# Altium schematic sheet 04_ZYNQ_CLOCK&PIN_CONFIG.SchDoc
size A4; SheetNumber: 5; SheetTotal: 5
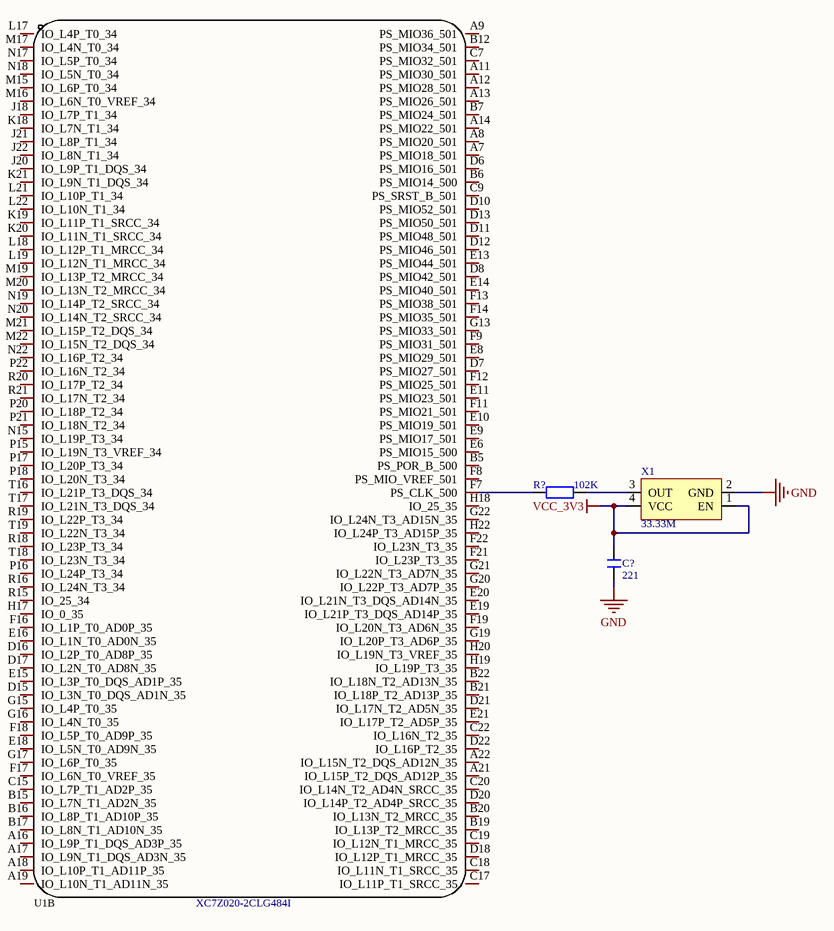
[diagram p0: 04_ZYNQ_CLOCK&PIN_CONFIG.SchDoc]

## Parts
C?  221  [C 0402]
R?  102K  [R 0402]
U1  XC7Z020-2CLG484I  [FPBGA-484_L19.0-W19.0-R22-C22-P0.80-BL]  (part B of 4)
X1  33.33M  [XTAL-3225 - S]

## Nets
GND: C?.1 X1.2(GND)
VCC_3V3: C?.2 X1.1(EN) X1.4(VCC)
NetR?_1: R?.1 U1.F7(PS_CLK_500)
NetR?_2: R?.2 X1.3(OUT)

Not connected (* = marked no-connect by the designer): U1 A7(PS_MIO18_501) A8(PS_MIO20_501) A9(PS_MIO36_501) A11(PS_MIO30_501) A12(PS_MIO28_501) A13(PS_MIO26_501) A14(PS_MIO22_501) A16(IO_L9P_T1_DQS_AD3P_35) A17(IO_L9N_T1_DQS_AD3N_35) A18(IO_L10P_T1_AD11P_35) A19(IO_L10N_T1_AD11N_35) A21(IO_L15P_T2_DQS_AD12P_35) A22(IO_L15N_T2_DQS_AD12N_35) B5(PS_POR_B_500) B6(PS_MIO14_500) B7(PS_MIO24_501) B12(PS_MIO34_501) B15(IO_L7N_T1_AD2N_35) B16(IO_L8P_T1_AD10P_35) B17(IO_L8N_T1_AD10N_35) B19(IO_L13P_T2_MRCC_35) B20(IO_L13N_T2_MRCC_35) B21(IO_L18P_T2_AD13P_35) B22(IO_L18N_T2_AD13N_35) C7(PS_MIO32_501) C9(PS_SRST_B_501) C15(IO_L7P_T1_AD2P_35) C17(IO_L11P_T1_SRCC_35) C18(IO_L11N_T1_SRCC_35) C19(IO_L12N_T1_MRCC_35) C20(IO_L14N_T2_AD4N_SRCC_35) C22(IO_L16N_T2_35) D6(PS_MIO16_501) D7(PS_MIO27_501) D8(PS_MIO42_501) D10(PS_MIO52_501) D11(PS_MIO48_501) D12(PS_MIO46_501) D13(PS_MIO50_501) D15(IO_L3N_T0_DQS_AD1N_35) D16(IO_L2P_T0_AD8P_35) D17(IO_L2N_T0_AD8N_35) D18(IO_L12P_T1_MRCC_35) D20(IO_L14P_T2_AD4P_SRCC_35) D21(IO_L17N_T2_AD5N_35) D22(IO_L16P_T2_35) E6(PS_MIO15_500) E8(PS_MIO29_501) E9(PS_MIO17_501) E10(PS_MIO19_501) E11(PS_MIO23_501) E13(PS_MIO44_501) E14(PS_MIO40_501) E15(IO_L3P_T0_DQS_AD1P_35) E16(IO_L1N_T0_AD0N_35) E18(IO_L5N_T0_AD9N_35) E19(IO_L21P_T3_DQS_AD14P_35) E20(IO_L21N_T3_DQS_AD14N_35) E21(IO_L17P_T2_AD5P_35) F8(PS_MIO_VREF_501) F9(PS_MIO31_501) F11(PS_MIO21_501) F12(PS_MIO25_501) F13(PS_MIO38_501) F14(PS_MIO35_501) F16(IO_L1P_T0_AD0P_35) F17(IO_L6N_T0_VREF_35) F18(IO_L5P_T0_AD9P_35) F19(IO_L20N_T3_AD6N_35) F21(IO_L23P_T3_35) F22(IO_L23N_T3_35) G13(PS_MIO33_501) G15(IO_L4P_T0_35) G16(IO_L4N_T0_35) G17(IO_L6P_T0_35) G19(IO_L20P_T3_AD6P_35) G20(IO_L22P_T3_AD7P_35) G21(IO_L22N_T3_AD7N_35) G22(IO_L24N_T3_AD15N_35) H17(IO_0_35) H18(IO_25_35) H19(IO_L19P_T3_35) H20(IO_L19N_T3_VREF_35) H22(IO_L24P_T3_AD15P_35) J18(IO_L7P_T1_34) J20(IO_L9P_T1_DQS_34) J21(IO_L8P_T1_34) J22(IO_L8N_T1_34) K18(IO_L7N_T1_34) K19(IO_L11P_T1_SRCC_34) K20(IO_L11N_T1_SRCC_34) K21(IO_L9N_T1_DQS_34) L17(IO_L4P_T0_34) L18(IO_L12P_T1_MRCC_34) L19(IO_L12N_T1_MRCC_34) L21(IO_L10P_T1_34) L22(IO_L10N_T1_34) M15(IO_L6P_T0_34) M16(IO_L6N_T0_VREF_34) M17(IO_L4N_T0_34) M19(IO_L13P_T2_MRCC_34) M20(IO_L13N_T2_MRCC_34) M21(IO_L15P_T2_DQS_34) M22(IO_L15N_T2_DQS_34) N15(IO_L19P_T3_34) N17(IO_L5P_T0_34) N18(IO_L5N_T0_34) N19(IO_L14P_T2_SRCC_34) N20(IO_L14N_T2_SRCC_34) N22(IO_L16P_T2_34) P15(IO_L19N_T3_VREF_34) P16(IO_L24P_T3_34) P17(IO_L20P_T3_34) P18(IO_L20N_T3_34) P20(IO_L18P_T2_34) P21(IO_L18N_T2_34) P22(IO_L16N_T2_34) R15(IO_25_34) R16(IO_L24N_T3_34) R18(IO_L23P_T3_34) R19(IO_L22P_T3_34) R20(IO_L17P_T2_34) R21(IO_L17N_T2_34) T16(IO_L21P_T3_DQS_34) T17(IO_L21N_T3_DQS_34) T18(IO_L23N_T3_34) T19(IO_L22N_T3_34)

## Library data of the parts
C? = C: 无极性贴片电容; 版权归属: 源创客; BOM名称: 无极性贴片电容; 学习资源: www.ooocke.com
R? = R: 贴片电阻; 版权归属: 源创客; BOM名称: 贴片电阻; 学习资源: www.ooocke.com
U1 = XC7Z020-2CLG484I: Manufacturer: XILINX(赛灵思); Add into BOM: yes; Paste Type: expand; Name: XC7Z020-2CLG484I; Symbol: XC7Z020-2CLG484I; Device: XC7Z020-2CLG484I; LCSC Part Name: XC7Z020-2CLG484I; Supplier Part: C157624; Manufacturer Part: XC7Z020-2CLG484I; Supplier Footprint: CSPBGA-484; JLCPCB Part Class: Extended Part; Datasheet: https://atta.szlcsc.com/upload/public/pdf/source/20180115/C157624_15160149665121269420.pdf; Supplier: LCSC; Convert to PCB: yes; Assembly Type: smtWeld
X1 = XTAL-4P_S: 4脚有源晶振; BOM名称: 4脚晶振; 版权归属: 源创客; 学习资源: www.ooocke.com